# Altium schematic sheet EE-02 pcbmodule.SchDoc: EE-02 nRF52 LoRa (SX1276) Module
size A4; Author: Thoma Langås; DocumentNumber: 1; SheetNumber: 1; SheetTotal: 5
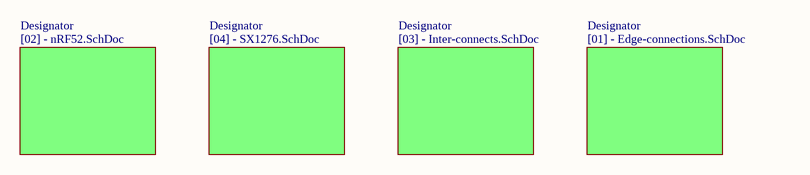
[diagram p0: EE-02 pcbmodule.SchDoc]

## Sub-sheets
Designator = [02] - nRF52.SchDoc: no entries
Designator = [04] - SX1276.SchDoc: no entries
Designator = [03] - Inter-connects.SchDoc: no entries
Designator = [01] - Edge-connections.SchDoc: no entries

## Notes on the sheet
- Title
- Size:
- Date:
- A4
- Number:
- Time:
- Revision:
- Sheet
- of
- File: